# Altium schematic sheet Voltage_measurement.SchDoc
size A4; SheetNumber: 4; SheetTotal: 9; SPICEModelCacheGQXFUCOC: <root> / <DocumentId>GQXFUCOC</DocumentId> / <CacheFrame Number="0"> / <Model Name="mcp6001" Kind="CKT"> / <Text>.SUBCKT MCP6001 1 2 3 4 5 / *               | | | | | / *               | | | | Output / *               | | | Negative Supply / *               | | Positive Supply / *               | Inverting Input / *               Non-inverting Input / * / ******************************************************************************** / * Software License Agreement                                                   * / *                                                                              * / * The software supplied herewith by Microchip Technology Incorporated (the     * / * "Company") is intended and supplied to you, the Company's customer, for use  * / * soley and exclusively on Microchip products.                                 * / *                                                                              * / * The software is owned by the Company and/or its supplier, and is protected   * / * under applicable copyright laws. All rights are reserved. Any use in         * / * violation of the foregoing restrictions may subject the user to criminal     * / * sanctions under applicable laws, as well as to civil liability for the       * / * breach of the terms and conditions of this license.                          * / *                                                                              * / * THIS SOFTWARE IS PROVIDED IN AN "AS IS" CONDITION. NO WARRANTIES, WHETHER    * / * EXPRESS, IMPLIED OR STATUTORY, INCLUDING, BUT NOT LIMITED TO, IMPLIED        * / * WARRANTIES OF MERCHANTABILITY AND FITNESS FOR A PARTICULAR PURPOSE APPLY TO  * / * THIS SOFTWARE. THE COMPANY SHALL NOT, IN ANY CIRCUMSTANCES, BE LIABLE FOR    * / * SPECIAL, INCIDENTAL OR CONSEQUENTIAL DAMAGES, FOR ANY REASON WHATSOEVER.     * / ******************************************************************************** / * / * Macromodel for the MCP6001/2/4 op amp family: / *   MCP6001, MCP6001R, MCP6001U, MCP6002, MCP6004 / * / * Revision History: / *   REV A: 21-Jun-02, Created model / *   REV B: 16-Jul-02, Improved output stage / *   REV C: 03-Jan-03, Added MCP6001 / *   REV D: 19-Aug-06, Added over temperature, improved output stage, / *                     fixed overdrive recovery time / *   REV E: 27-Jul-07, Updated output impedance for better model stability w/cap load / *   REV F: 09-Jul-12, Added MCP6001R, MCP6001U / * / * Recommendations: / *   Use PSPICE (other simulators may require translation) / *   For a quick, effective design, use a combination of: data sheet / *     specs, bench testing, and simulations with this macromodel / *   For high impedance circuits, set GMIN=100F in .OPTIONS / * / * Supported: / *   Typical performance for temperature range (-40 to 125) degrees Celsius / *   DC, AC, Transient, and Noise analyses. / *   Most specs, including: offsets, DC PSRR, DC CMRR, input impedance, / *     open loop gain, voltage ranges, supply current, ... , etc. / *   Temperature effects for Ibias, Iquiescent, Iout short circuit / *   current, Vsat on both rails, Slew Rate vs. Temp and P.S. / * / * Not Supported: / *   Some Variation in specs vs. Power Supply Voltage / *   Monte Carlo (Vos, Ib), Process variation / *   Distortion (detailed non-linear behavior) / *   Behavior outside normal operating region / * / * Input Stage / V10  3 10 -500M / R10 10 11 6.90K / R11 10 12 6.90K / C11 11 12 0.2p / C12 1  0 6.00P / E12 71 14 POLY(4) 20 0 21 0 26 0 27 0   1.00M 20.1 20.1 1 1 / G12 1 0 62 0 1m / M12 11 14 15 15 NMI L=2.00U W=42.0U / M14 12  2 15 15 NMI L=2.00U W=42.0U / G14 2 0 62 0 1m / C14  2  0 6.00P / I15 15  4 50.0U / V16 16  4 -300M / GD16 16 1 TABLE {V(16,1)} ((-100,-1p)(0,0)(1m,1n)(2m,1m)(3m,1)) / V13  3 13 -300M / GD13 2 13 TABLE {V(2,13)} ((-100,-1p)(0,0)(1m,1n)(2m,1m)(3m,1)) / R70 1 0 20.6T / R71 2 0 20.6T / R72 1 2 20T / I80 1 2 0.5p / * / * Noise, PSRR, and CMRR / I20 21 20 423U / D20 20  0 DN1 / D21  0 21 DN1 / G26  0 26 POLY(1) 3 4   110U -49U / R26 26  0 1 / G27  0 27 POLY(2) 1 0 2 0   -440U 39.7U 39.7U / R27 27  0 1 / * / * Open Loop Gain, Slew Rate / G30  0 30 POLY(1) 12 11   0 1 / R30 30  0 1K / G31  0 31 POLY(1) 3 4 86 5.25 / R31 31  0 1 TC=2.8m / GD31 30 31 TABLE {V(30,31)} ((-11,-1)(-10,-10n)(0,0)(1m,1000)) / G32 32  0 POLY(1) 3 4 113.7 3.5 / R32 32  0 1 TC=2.65m / GD32 30 32 TABLE {V(30,32)} ((-1m,-1000)(0,0)(10,10n)(11,1)) / G33 0 33 30 0 1m / R33 33 0 1k / G34  0 34 33 0 425M / R34  34 0 1K / C34  34 0 74U / G37  0 37 34 0 1m / R37  37 0 1K / C37  37 0 41.6P / G38  0 38 37 0 1m / R38  39 0 1K / L38  38 39 100U / E38  35 0 38 0 1 / G35 33 0 TABLE {V(35,3)} ((-1,-1n)(0,0)(16,1n))(16.1,1)) / G36 33 0 TABLE {V(35,4)} ((-16.1,-1)((-16,-1n)(0,0)(1,1n)) / * / * Output Stage / R80 50 0 100MEG / G50 0 50 57 96 2 / R58 57  96 0.50 / R57 57  0 750 / C58  5  0 2.00P / G57  0 57 POLY(3) 3 0 4 0 35 0   0 0.67M 0.67M 1.5M / GD55 55 57 TABLE {V(55,57)} ((-2m,-1)(-1m,-1m)(0,0)(10,1n)) / GD56 57 56 TABLE {V(57,56)} ((-2m,-1)(-1m,-1m)(0,0)(10,1n)) / E55 55  0 POLY(2) 3 0 51 0 -0.7m 1 -40.0M / E56 56  0 POLY(2) 4 0 52 0 1.2m 1 -37.0M / R51 51 0 1k / R52 52 0 1k / GD51 50 51 TABLE {V(50,51)} ((-10,-1n)(0,0)(1m,1m)(2m,1)) / GD52 50 52 TABLE {V(50,52)} ((-2m,-1)(-1m,-1m)(0,0)(10,1n)) / G53  3  0 POLY(1) 51 0  -49U 1M / G54  0  4 POLY(1) 52 0  -49U -1M / * / * Current Limit / G99 96 5 99 0 1 / R98 0 98 1 TC=-2.8M,2.63U / G97 0 98 TABLE { V(96,5) } ((-11.0,-10.0M)(-1.00M,-9.9M)(0,0)(1.00M,9.9M)(11.0,10.0M)) / E97 99 0 VALUE { V(98)*((V(3)-V(4))*359M + 310M)} / D98 4 5 DESD / D99 5 3 DESD / * / * Temperature / Voltage Sensitive IQuiscent / R61 0 61 100 TC 3.11M 4.51U / G61 3 4 61 0 1 / G60 0 61 TABLE {V(3, 4)} / + ((0,0)(900M,0.0106U)(1.00,0.20U)(1.3,0.63U) / + (1.5,0.66U)(1.6,1.06U)(5.5,1.10U)) / * / * Temp Sensitive offset voltage / I73 0 70 DC 1uA / R74 0 70 1 TC=2 / E75 1 71 70 0 1 / * / * Temp Sensistive IBias / I62 0 62 DC 1uA / R62 0 62 REXP 58.2u / * Voltage on R62 used for G12, G14 in input stage / * / * Models / .MODEL NMI NMOS / .MODEL DESD  D   N=1 IS=1.00E-15 / .MODEL DL  D   N=1 IS=1F / .MODEL DN1 D   IS=1P KF=146E-18 AF=1 / .MODEL REXP RES TCE=10.1 / .ENDS MCP6001</Text> / </Model> / </CacheFrame> / </root>
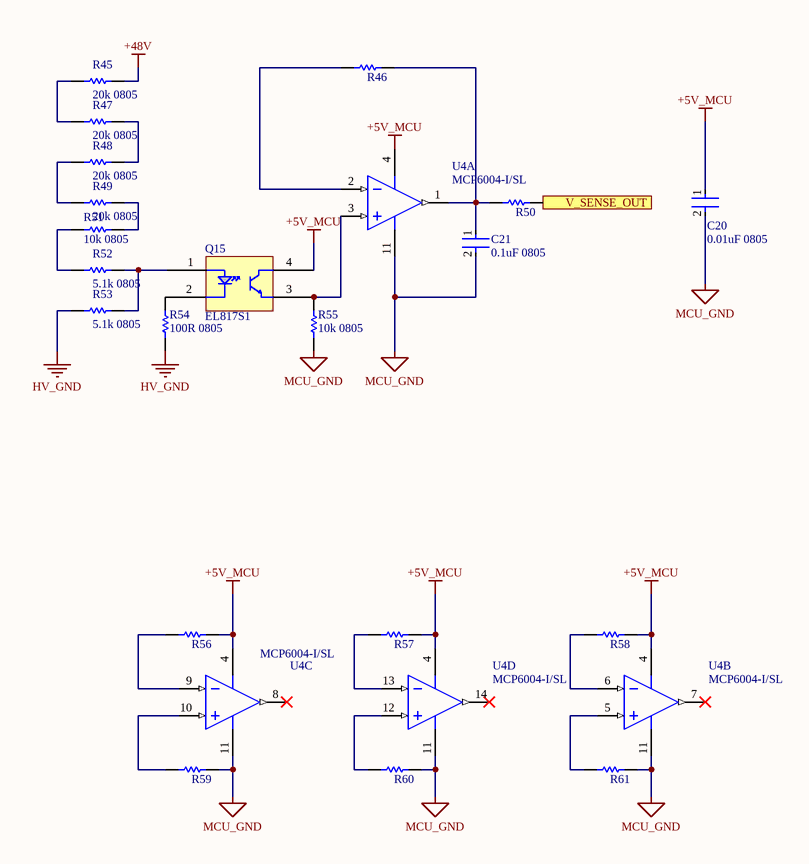
[diagram p0: Voltage_measurement.SchDoc]

## Parts
C20  0.01uF 0805  [R0805]
C21  0.1uF 0805  [R0805]
Q15  EL817S1  [EL817S1]
R45  20k 0805  [R0805]
R46  0R 0603  [R0603]  (value not drawn)
R47  20k 0805  [R0805]
R48  20k 0805  [R0805]
R49  20k 0805  [R0805]
R50  0R 0603  [R0603]  (value not drawn)
R51  10k 0805  [R0805]
R52  5.1k 0805  [R0805]
R53  5.1k 0805  [R0805]
R54  100R 0805  [R0805]
R55  10k 0805  [R0805]
R56  0R 0603  [R0603]  (value not drawn)
R57  0R 0603  [R0603]  (value not drawn)
R58  0R 0603  [R0603]  (value not drawn)
R59  0R 0603  [R0603]  (value not drawn)
R60  0R 0603  [R0603]  (value not drawn)
R61  0R 0603  [R0603]  (value not drawn)
U4  MCP6004-I/SL  [SOIC-SL14_M]  (parts A,B,C,D of 4)

## Ports
V_SENSE_OUT (out)

## Nets
+5V_MCU: C20.1 Q15.4(C) R56.1 R57.1 R58.1 U4.4(VDD)
+48V: R45.2
HV_GND: R53.1 R54.1
MCU_GND: C20.2 C21.2 R55.1 R59.1 R60.1 R61.1 U4.11(VSS)
V_SENSE_OUT: R50.1 ; port V_SENSE_OUT
NetC21_1: C21.1 R46.1 R50.2 U4.1(VOUTA)
NetQ15_1: Q15.1(A) R52.2 R53.2
NetQ15_2: Q15.2(K) R54.2
NetQ15_3: Q15.3(E) R55.2 U4.3(VINA+)
NetR45_1: R45.1 R47.1
NetR46_2: R46.2 U4.2(VINA-)
NetR47_2: R47.2 R48.2
NetR48_1: R48.1 R49.1
NetR49_2: R49.2 R51.1
NetR51_2: R51.2 R52.1
NetR56_2: R56.2 U4.9(VINC-)
NetR57_2: R57.2 U4.13(VIND-)
NetR58_2: R58.2 U4.6(VINB-)
NetR59_2: R59.2 U4.10(VINC+)
NetR60_2: R60.2 U4.12(VIND+)
NetR61_2: R61.2 U4.5(VINB+)

Not connected (* = marked no-connect by the designer): U4 7(VOUTB)* 8(VOUTC)* 14(VOUTD)*

## Library data of the parts
C20 = 0.01uF 0805: 10nF/0.01uF 50V Capacitor ±10% Tolerance 0805B103K500CT – 0805 Package; Product URL: https://sharvielectronics.com/product/10nf-0-01uf-50v-capacitor-%c2%b110-tolerance-0805b103k500ct-0805-package/; Price per piece: 2.45; Datasheet: https://drive.google.com/file/d/18RHnvRuuuVekgJyOA4l8O3UUaSpuKbHR/view?usp=sharing
C21 = 0.1uF 0805: 0.1uF/100nF 100V Capacitor ±10% Tolerance CC0805KKX7R0BB104 – 0805 Package; Product URL: https://sharvielectronics.com/product/0-1uf-100nf-100v-capacitor-%c2%b110-tolerance-cc0805kkx7r0bb104-0805-package/; Price per piece: 4.76; Datasheet: https://drive.google.com/file/d/1wr2K_YaGqgMtACeU2pC6RWLSxDMrIPxr/view?usp=sharing
Q15 = EL817S1: EL817S1 (B) (TU) – F Optocoupler SMD-4 Cut Tape; Product URL: https://sharvielectronics.com/product/el817s1-b-tu-f-optocoupler-smd-4-cut-tape/; Price per piece: 7.45; Datasheet: https://sharvielectronics.com/wp-content/uploads/2021/09/EL817-Optocoupler.pdf
R45 R47-R49 = R0805: 20K ohm 1/8 Watt SMD Resistor 1% Tolerance RC0805FR-0720KL – 0805 Package; Price per piece: 1.15; Product URL: https://sharvielectronics.com/product/20k-ohm-1-8-watt-smd-resistor-1-tolerance-rc0805fr-0720kl-0805-package/; Datasheet: https://drive.google.com/file/d/1pkLQT_RQ1i35oFQcGREpZr7Oy3Ppi-ZT/view?usp=sharing
R46 R50 R56-R61 = R0000 0603: 0 Ohm 1/10 Watt Resistor 1% Tolerance RC0603FR-070RL – 0603 Package; Price per piece: 0.97; Product URL: https://sharvielectronics.com/product/0-ohm-1-10-watt-resistor-1-tolerance-rc0603fr-070rl-0603-package/; Datasheet: https://drive.google.com/file/d/1pkLQT_RQ1i35oFQcGREpZr7Oy3Ppi-ZT/view?usp=sharing
R51 R55 = 10k 0805: 10K Ohm 1/8 Watt Resistor 1% Tolerance RC0805FR-0710KL – 0805 Package; Price per piece: 0.82; Product URL: https://sharvielectronics.com/product/10k-ohm-1-8-watt-resistor-1-tolerance-rc0805fr-0710kl-0805-package/; Datasheet: https://drive.google.com/file/d/1pkLQT_RQ1i35oFQcGREpZr7Oy3Ppi-ZT/view?usp=sharing
R52 R53 = R0805: 5.1K Ohm 1/8 Watt Resistor 1% Tolerance 0805S8F5101T5E – 0805 Package; Price per piece: 1.92; Product URL: https://sharvielectronics.com/product/5-1k-ohm-1-8-watt-resistor-1-tolerance-0805s8f5101t5e-0805-package/; Datasheet: https://drive.google.com/file/d/1rtx85iFJaMrDbsv7PAzG9bTFItPmAE38/view?usp=sharing
R54 = 100R 0805: 100 ohm 1/4W Resistor 0805 Package; Price per piece: 0.82; Product URL: https://sharvielectronics.com/product/100-ohm-1-4w-resistor-0805-package/; Datasheet: *
U4 = CMP-0187-00321-3: MCP6004 1MHz Rail-to-Rail Operational Amplifier – SOIC-14 Package; Number of Channels: 4; Amplifier Type: GENERAL PURPOSE; Common Mode Rejection Ratio: 60dB; Voltage Gain: 112dB; Min Supply Voltage: 1.8V; Slew Rate-Nom: 0.6V/µs; Supply Current: 100uA; Input Offset Voltage-Max: 4.5mV; Power Supply Rejection Ratio (PSRR): 86dB; Output Current: 23mA; Operating Supply Voltage: 5.5V; Input Bias Current: 1pA; Max Supply Voltage: 6V; RoHS Compliant: Yes; Technology: CMOS; Radiation Hardening: No; Bandwidth: 1MHz; Number of Elements: 4; REACH SVHC: No SVHC; Number of Amplifiers: 4; Lead Free: Lead Free; Contact Plating: Tin; Max Operating Temperature: 85°C; Packaging: Rail/Tube; Number of Pins: 14; Case/Package: SOIC; Width: 3.9mm; Length: 8.65mm; Unity Gain Bandwidth Product: 1MHz; Gain Bandwidth Product: 1MHz; Input Offset Voltage (Vos): 4.5mV; Package Quantity: 57; Number of Circuits: 4; Min Operating Temperature: -40°C; Nominal Supply Current: 100uA; Height: 1.25mm; Slew Rate: 0.6V/µs; Mount: Surface Mount; Product URL: https://sharvielectronics.com/product/mcp6004-1mhz-rail-to-rail-operational-amplifier-soic-14-package/; Datasheet: https://ww1.microchip.com/downloads/en/DeviceDoc/MCP6001-1R-1U-2-4-1-MHz-Low-Power-Op-Amp-DS20001733L.pdf; Price per piece: 38.45